# EAGLE schematic PIC32try1 (EAGLE 5.12)
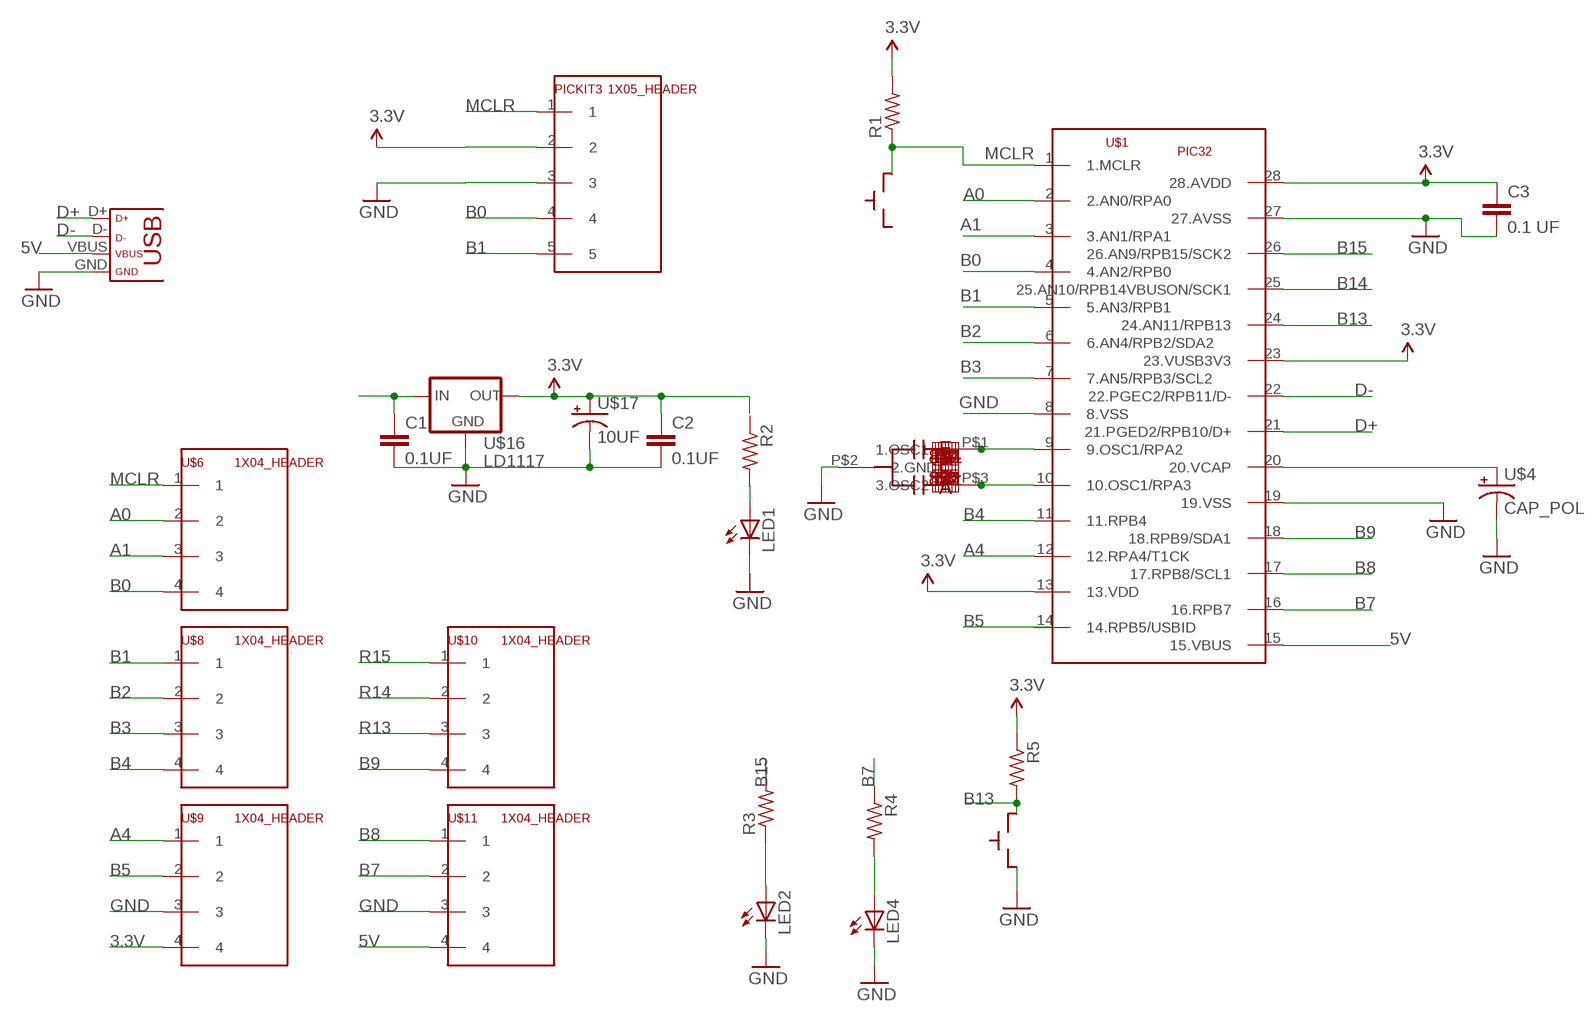
[diagram p0: schematic, sheet 1]

## Parts
8MHZ  CRYST2  [CRYST2]
C1  0.1UF  C-EU025-025X050  [C025-025X050]
C2  0.1UF  C-EU025-025X050  [C025-025X050]
C3  0.1 UF  C-EU025-025X050  [C025-025X050]
LED1  LED3MM  [LED3MM]
LED2  LED3MM  [LED3MM]
LED4  LED3MM  [LED3MM]
PICKIT3  1X05_HEADER  [1X05]
R1  R-US_0309/12  [0309/12]
R2  R-US_0309/12  [0309/12]
R3  R-US_0309/12  [0309/12]
R4  R-US_0309/12  [0309/12]
R5  R-US_0309/12  [0309/12]
U$1  PIC32  [DIL28-3]
U$3  PUSHBUTTON  [1X03]
U$4  CAP_POL  [CAP_POL_D]
U$5  PUSHBUTTON  [1X03]
U$6  1X04_HEADER  [1X04]
U$8  1X04_HEADER  [1X04]
U$9  1X04_HEADER  [1X04]
U$10  1X04_HEADER  [1X04]
U$11  1X04_HEADER  [1X04]
U$15  USB  [USB-MINIB]
U$16  LD1117  [TO220]
U$17  10UF  CAP_POL  [CAP_POL_D]

## Nets
3.3V: C2.1 C3.1 PICKIT3.2 R1.2 R5.1 U$1.13(13.VDD) U$1.23(23.VUSB3V3) U$1.28(28.AVDD) U$9.4 U$16.2(OUT) U$17.1(+)
5V: U$1.15(15.VBUS) U$11.4 U$15.VBUS
A0: U$1.2(2.AN0/RPA0) U$6.2
A1: U$1.3(3.AN1/RPA1) U$6.3
A4: U$1.12(12.RPA4/T1CK) U$9.1
B0: PICKIT3.4 U$1.4(4.AN2/RPB0) U$6.4
B1: PICKIT3.5 U$1.5(5.AN3/RPB1) U$8.1
B2: U$1.6(6.AN4/RPB2/SDA2) U$8.2
B3: U$1.7(7.AN5/RPB3/SCL2) U$8.3
B4: U$1.11(11.RPB4) U$8.4
B5: U$9.2
B7: R4.1 U$1.16(16.RPB7) U$11.2
B8: U$1.17(17.RPB8/SCL1) U$11.1
B9: U$1.18(18.RPB9/SDA1) U$10.4
B13: R5.2 U$1.24(24.AN11/RPB13)
B14: U$1.25(25.AN10/RPB14VBUSON/SCK1)
B15: R3.2 U$1.26(26.AN9/RPB15/SCK2)
D+: U$1.21(21.PGED2/RPB10/D+) U$15.D+
D-: U$1.22(22.PGEC2/RPB11/D-) U$15.D-
GND: 8MHZ.P$2(2.GND) C1.2 C2.2 C3.2 LED2.K(C) LED4.K(C) PICKIT3.3 U$1.8(8.VSS) U$1.19(19.VSS) U$1.27(27.AVSS) U$4.2(-) U$9.3 U$11.3 U$15.GND U$16.1(GND) U$17.2(-)
MCLR: PICKIT3.1 R1.1 U$1.1(1.MCLR) U$6.1
N$2: C1.1 U$16.3(IN)
N$4: LED1.K(C)
N$5: LED1.A
N$6: LED2.A R3.1
N$7: LED4.A R4.2
N$8: 8MHZ.P$1(1.OSC1) U$1.9(9.OSC1/RPA2)
N$9: 8MHZ.P$3(3.OSC2) U$1.10(10.OSC1/RPA3)
N$22: U$1.20(20.VCAP) U$4.1(+)
R13: U$10.3
R14: U$10.2
R15: U$10.1
Unconnected: R2.1 R2.2 U$1.14(14.RPB5/USBID)

## Library data of the parts
8MHZ = ME433:CRYST2
C1-C3 = ME433:C-EU: CAPACITOR, European symbol
LED1 LED2 LED4 = led:LED: LED OSRAM: - CHIPLED LG R971, LG N971, LY N971, LG Q971, LY Q971, LO R971, LY R971 LH N974, LH R974 LS Q976, LO Q976, LY Q976 LO Q996 - Hyper CHIPLED LW Q18S LB Q993, LB Q99A, LB R99A - SideLED LS A670, LO A670, LY A670, LG A670, LP A670 LB A673, LV A673, LT A673, LW A673 LH A674 LY A675 LS A676, LA A676, LO A676, LY A676, LW A676 LS A679, LY A679, LG A679 - Hyper Micro SIDELED® LS Y876, LA Y876, LO Y876, LY Y876 LT Y87S - SmartLED LW L88C, LW L88S LB L89C, LB L89S, LG L890 LS L89K, LO L89K, LY L89K LS L896, LA L896, LO L896, LY L896 - TOPLED LS T670, LO T670, LY T670, LG T670, LP T670 LSG T670, LSP T670, LSY T670, LOP T670, LYG T670 LG T671, LOG T671, LSG T671 LB T673, LV T673, LT T673, LW T673 LH T674 LS T676, LA T676, LO T676, LY T676, LB T676, LH T676, LSB T676, LW T676 LB T67C, LV T67C, LT T67C, LS T67K, LO T67K, LY T67K, LW E67C LS E67B, LA E67B, LO E67B, LY E67B, LB E67C, LV E67C, LT E67C LW T67C LS T679, LY T679, LG T679 LS T770, LO T770, LY T770, LG T770, LP T770 LB T773, LV T773, LT T773, LW T773 LH T774 LS E675, LA E675, LY E675, LS T675 LS T776, LA T776, LO T776, LY T776, LB T776 LHGB T686 LT T68C, LB T68C - Hyper Mini TOPLED® LB M676 - Mini TOPLED Santana® LG M470 LS M47K, LO M47K, LY M47K Source: http://www.osram.convergy.de LUXEON: - LUMILED® LXK2-PW12-R00, LXK2-PW12-S00, LXK2-PW14-U00, LXK2-PW14-V00 LXK2-PM12-R00, LXK2-PM12-S00, LXK2-PM14-U00 LXK2-PE12-Q00, LXK2-PE12-R00, LXK2-PE12-S00, LXK2-PE14-T00, LXK2-PE14-U00 LXK2-PB12-K00, LXK2-PB12-L00, LXK2-PB12-M00, LXK2-PB14-N00, LXK2-PB14-P00, LXK2-PB14-Q00 LXK2-PR12-L00, LXK2-PR12-M00, LXK2-PR14-Q00, LXK2-PR14-R00 LXK2-PD12-Q00, LXK2-PD12-R00, LXK2-PD12-S00 LXK2-PH12-R00, LXK2-PH12-S00 LXK2-PL12-P00, LXK2-PL12-Q00, LXK2-PL12-R00 Source: www.luxeon.com KINGBRIGHT: KA-3528ASYC Source: www.kingbright.com
PICKIT3 = ME433:1X05_HEADER
R1-R5 = resistor:R-US_: RESISTOR, American symbol
U$1 = ME433:PIC32
U$3 U$5 = ME433:PUSHBUTTON
U$4 U$17 = ME433:CAP_POL
U$6 U$8-U$11 = ME433:1X04_HEADER
U$15 = ME433:USB
U$16 = ME433:LD1117